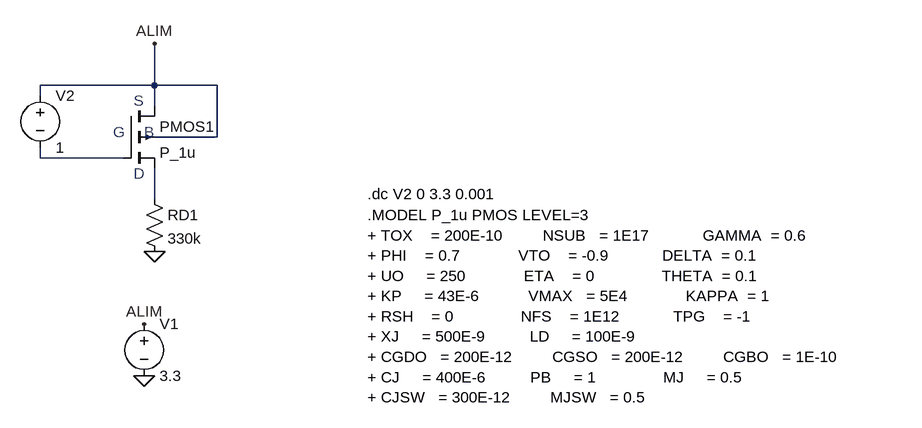
[diagram p0: schematic Simulation_gm.asc]
Simulation_gm.asc, the LTspice schematic file:
Version 4
SHEET 1 892 680
WIRE -288 -64 -288 -128
WIRE -288 -64 -464 -64
WIRE -192 -64 -288 -64
WIRE -464 -48 -464 -64
WIRE -288 -32 -288 -64
WIRE -192 16 -192 -64
WIRE -192 16 -288 16
WIRE -464 48 -464 32
WIRE -336 48 -464 48
WIRE -288 112 -288 64
FLAG -304 304 ALIM
FLAG -304 384 0
FLAG -288 192 0
FLAG -288 -128 ALIM
SYMBOL voltage -304 288 R0
WINDOW 123 0 0 Left 0
WINDOW 39 0 0 Left 0
SYMATTR InstName V1
SYMATTR Value 3.3
SYMBOL pmos4 -336 -32 R0
SYMATTR InstName PMOS1
SYMATTR Value P_1u
SYMATTR Value2 l=1u w=2.5u
SYMBOL res -304 96 R0
SYMATTR InstName RD1
SYMATTR Value 330k
SYMBOL voltage -464 -64 R0
WINDOW 123 0 0 Left 0
WINDOW 39 0 0 Left 0
SYMATTR InstName V2
SYMATTR Value 1
TEXT 40 104 Left 2 !.dc V2 0 3.3 0.001
TEXT -320 -40 Left 2 ;S
TEXT -352 8 Left 2 ;G
TEXT -304 8 Left 2 ;B
TEXT -320 72 Left 2 ;D
TEXT 40 136 Left 2 !.MODEL P_1u PMOS LEVEL=3\n+ TOX    = 200E-10         NSUB   = 1E17            GAMMA  = 0.6          \n+ PHI    = 0.7             VTO    = -0.9            DELTA  = 0.1          \n+ UO     = 250             ETA    = 0               THETA  = 0.1         \n+ KP     = 43E-6           VMAX   = 5E4             KAPPA  = 1         \n+ RSH    = 0               NFS    = 1E12            TPG    = -1                 \n+ XJ     = 500E-9          LD     = 100E-9               \n+ CGDO   = 200E-12         CGSO   = 200E-12         CGBO   = 1E-10              \n+ CJ     = 400E-6          PB     = 1               MJ     = 0.5                \n+ CJSW   = 300E-12         MJSW   = 0.5

The netlist it stands for:
* Simulation_gm.asc
V1 ALIM 0 3.3
M§PMOS1 ALIM N001 N002 ALIM P_1u l=1u w=2.5u
RD1 N002 0 330k
V2 ALIM N001 1
.model NMOS NMOS
.model PMOS PMOS
.lib standard.mos
.dc V2 0 3.3 0.001
* S
* G
* B
* D
.MODEL P_1u PMOS LEVEL=3
+ TOX    = 200E-10         NSUB   = 1E17            GAMMA  = 0.6
+ PHI    = 0.7             VTO    = -0.9            DELTA  = 0.1
+ UO     = 250             ETA    = 0               THETA  = 0.1
+ KP     = 43E-6           VMAX   = 5E4             KAPPA  = 1
+ RSH    = 0               NFS    = 1E12            TPG    = -1
+ XJ     = 500E-9          LD     = 100E-9
+ CGDO   = 200E-12         CGSO   = 200E-12         CGBO   = 1E-10
+ CJ     = 400E-6          PB     = 1               MJ     = 0.5
+ CJSW   = 300E-12         MJSW   = 0.5
.backanno
.end